# EAGLE design US_sous_marin (EAGLE 5.11)
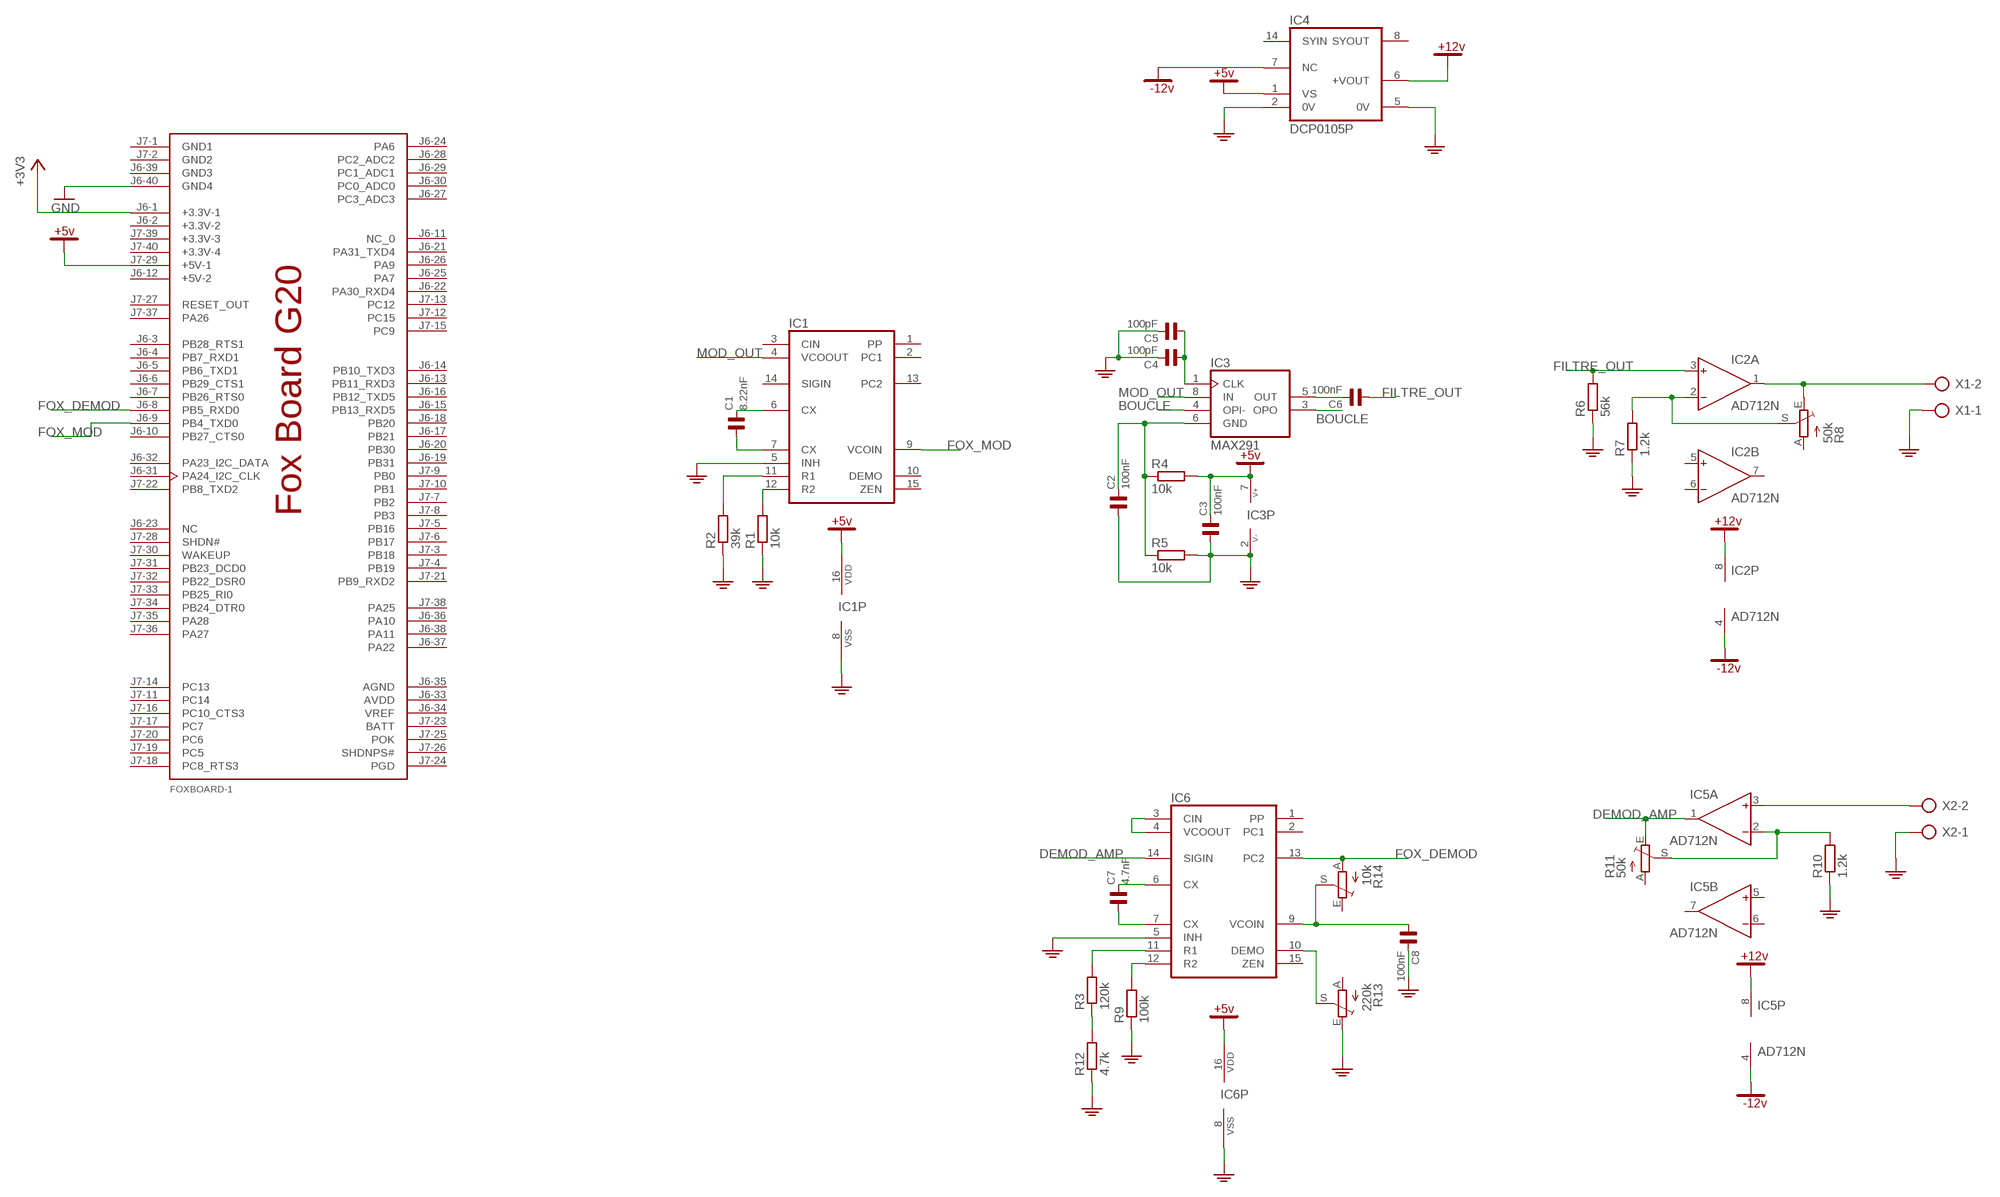
[diagram p0: schematic, sheet 1]

## Parts
C1  8.22nF  C5B2,5  [C5B2,5]
C2  100nF  C5B2,5E  [C5B2,5A]
C3  100nF  C5B2,5E  [C5B2,5A]
C4  100pF  C5B2,5  [C5B2,5]
C5  100pF  C5B2,5  [C5B2,5]
C6  100nF  C5B2,5E  [C5B2,5A]
C7  4.7nF  C5B2,5  [C5B2,5]
C8  100nF  C5B2,5E  [C5B2,5A]
FOXBOARD-1  FOX-BOARD  [FOX-BOARD]
IC1  4046  [DIL16]
IC2  AD712N  [DIL08]
IC3  MAX291  [DIL08]
IC4  DCP0105P  [DIL14/7]
IC5  AD712N  [DIL08]
IC6  4046  [DIL16]
R1  10k  R-EU_0309/12  [0309/12]
R2  39k  R-EU_0309/12  [0309/12]
R3  120k  R-EU_0309/12  [0309/12]
R4  10k  R-EU_0309/12  [0309/12]
R5  10k  R-EU_0309/12  [0309/12]
R6  56k  R-EU_0309/12  [0309/12]
R7  1.2k  R-EU_0309/12  [0309/12]
R8  50k  TRIM_EU-B90P  [SP19L]
R9  100k  R-EU_0309/12  [0309/12]
R10  1.2k  R-EU_0309/12  [0309/12]
R11  50k  TRIM_EU-B90P  [SP19L]
R12  4.7k  R-EU_0309/12  [0309/12]
R13  220k  TRIM_EU-B90P  [SP19L]
R14  10k  TRIM_EU-S63P  [S63P]
X1  AK300/2  [AK300/2]
X2  AK300/2  [AK300/2]

## Nets
+3V3: FOXBOARD-1.J6-1(+3.3V-1)
+5V: C3.2 FOXBOARD-1.J7-29(+5V-1) IC1.16(VDD) IC3.7(V+) IC4.1(VS) IC6.16(VDD) R4.2
+12V: IC2.8(P:V+) IC4.6(+VOUT) IC5.8(P:V+)
-12V: IC2.4(P:V-) IC4.7(NC) IC5.4(P:V-)
BOUCLE: IC3.3(OPO) IC3.4(OPI-)
DEMOD_AMP: IC5.1(A:OUT) IC6.14(SIGIN) R11.E
FILTRE_OUT: C6.1 IC2.3(A:IN+) R6.2
FOX_DEMOD: FOXBOARD-1.J6-8(PB5_RXD0) IC6.13(PC2) R14.A
FOX_MOD: FOXBOARD-1.J6-9(PB4_TXD0) IC1.9(VCOIN)
GND: C2.1 C3.1 C4.2 C5.2 C8.2 FOXBOARD-1.J6-40(GND4) IC1.5(INH) IC1.8(VSS) IC3.2(V-) IC4.2(0V) IC4.5(0V) IC6.5(INH) IC6.8(VSS) R1.1 R2.1 R5.2 R6.1 R7.1 R9.1 R10.1 R12.1 R13.E X1.1 X2.1
MOD_OUT: IC1.4(VCOOUT) IC3.8(IN)
N$1: C1.2 IC1.6(CX)
N$2: C1.1 IC1.7(CX)
N$3: IC1.12(R2) R1.2
N$4: IC1.11(R1) R2.2
N$5: IC6.12(R2) R9.2
N$6: C6.2 IC3.5(OUT)
N$7: C2.2 IC3.6(GND) R4.1 R5.1
N$9: C4.1 C5.1 IC3.1(CLK)
N$10: IC2.2(A:IN-) R7.2 R8.S
N$11: IC2.1(A:OUT) R8.E X1.2
N$12: IC5.3(A:IN+) X2.2
N$13: IC6.3(CIN) IC6.4(VCOOUT)
N$14: IC5.2(A:IN-) R10.2 R11.S
N$15: C7.2 IC6.6(CX)
N$16: C7.1 IC6.7(CX)
N$17: IC6.11(R1) R3.2
N$18: R3.1 R12.2
N$19: IC6.10(DEMO) R13.S
N$21: C8.1 IC6.9(VCOIN) R14.S
Unconnected: FOXBOARD-1.J6-3(PB28_RTS1) FOXBOARD-1.J6-4(PB7_RXD1) FOXBOARD-1.J6-5(PB6_TXD1) FOXBOARD-1.J6-6(PB29_CTS1) FOXBOARD-1.J6-7(PB26_RTS0) FOXBOARD-1.J6-10(PB27_CTS0) FOXBOARD-1.J6-11(NC_0) FOXBOARD-1.J6-13(PB11_RXD3) FOXBOARD-1.J6-14(PB10_TXD3) FOXBOARD-1.J6-15(PB13_RXD5) FOXBOARD-1.J6-16(PB12_TXD5) FOXBOARD-1.J6-17(PB21) FOXBOARD-1.J6-18(PB20) FOXBOARD-1.J6-19(PB31) FOXBOARD-1.J6-20(PB30) FOXBOARD-1.J6-21(PA31_TXD4) FOXBOARD-1.J6-22(PA30_RXD4) FOXBOARD-1.J6-23(NC) FOXBOARD-1.J6-24(PA6) FOXBOARD-1.J6-25(PA7) FOXBOARD-1.J6-26(PA9) FOXBOARD-1.J6-27(PC3_ADC3) FOXBOARD-1.J6-28(PC2_ADC2) FOXBOARD-1.J6-29(PC1_ADC1) FOXBOARD-1.J6-30(PC0_ADC0) FOXBOARD-1.J6-31(PA24_I2C_CLK) FOXBOARD-1.J6-32(PA23_I2C_DATA) FOXBOARD-1.J6-33(AVDD) FOXBOARD-1.J6-34(VREF) FOXBOARD-1.J6-35(AGND) FOXBOARD-1.J6-36(PA10) FOXBOARD-1.J6-37(PA22) FOXBOARD-1.J6-38(PA11) FOXBOARD-1.J7-3(PB18) FOXBOARD-1.J7-4(PB19) FOXBOARD-1.J7-5(PB16) FOXBOARD-1.J7-6(PB17) FOXBOARD-1.J7-7(PB2) FOXBOARD-1.J7-8(PB3) FOXBOARD-1.J7-9(PB0) FOXBOARD-1.J7-10(PB1) FOXBOARD-1.J7-11(PC14) FOXBOARD-1.J7-12(PC15) FOXBOARD-1.J7-13(PC12) FOXBOARD-1.J7-14(PC13) FOXBOARD-1.J7-15(PC9) FOXBOARD-1.J7-16(PC10_CTS3) FOXBOARD-1.J7-17(PC7) FOXBOARD-1.J7-18(PC8_RTS3) FOXBOARD-1.J7-19(PC5) FOXBOARD-1.J7-20(PC6) FOXBOARD-1.J7-21(PB9_RXD2) FOXBOARD-1.J7-22(PB8_TXD2) FOXBOARD-1.J7-23(BATT) FOXBOARD-1.J7-24(PGD) FOXBOARD-1.J7-25(POK) FOXBOARD-1.J7-26(SHDNPS#) FOXBOARD-1.J7-27(RESET_OUT) FOXBOARD-1.J7-28(SHDN#) FOXBOARD-1.J7-30(WAKEUP) FOXBOARD-1.J7-31(PB23_DCD0) FOXBOARD-1.J7-32(PB22_DSR0) FOXBOARD-1.J7-33(PB25_RI0) FOXBOARD-1.J7-34(PB24_DTR0) FOXBOARD-1.J7-35(PA28) FOXBOARD-1.J7-36(PA27) FOXBOARD-1.J7-37(PA26) FOXBOARD-1.J7-38(PA25) IC1.1(PP) IC1.2(PC1) IC1.3(CIN) IC1.10(DEMO) IC1.13(PC2) IC1.14(SIGIN) IC1.15(ZEN) IC2.5(B:IN+) IC2.6(B:IN-) IC2.7(B:OUT) IC4.8(SYOUT) IC4.14(SYIN) IC5.5(B:IN+) IC5.6(B:IN-) IC5.7(B:OUT) IC6.1(PP) IC6.2(PC1) IC6.15(ZEN) R8.A R11.A R13.A R14.E

## Power pins joined to a net without a drawn wire
+3.3V-2: FOXBOARD-1.J6-2(+3.3V-2)
+3.3V-3: FOXBOARD-1.J7-39(+3.3V-3)
+3.3V-4: FOXBOARD-1.J7-40(+3.3V-4)
+5V-2: FOXBOARD-1.J6-12(+5V-2)
GND1: FOXBOARD-1.J7-1(GND1)
GND2: FOXBOARD-1.J7-2(GND2)
GND3: FOXBOARD-1.J6-39(GND3)

## Library data of the parts
C1 C4 C5 C7 = CAP:C5B2,5
C2 C3 C6 C8 = CAP:C5B2,5E
FOXBOARD-1 = Julien:FOX-BOARD
IC1 IC6 = 40XX:4046
IC2 IC5 = analog-devices:AD712: Dual Precision, Low Cost, High Speed BiFET Op Amp Source: http://www.analog.com/static/imported-files/data_sheets/AD712.pdf; MF: ALTERA CORPORATION; MPN: AD712JNZ; OC_FARNELL: 9604898; OC_NEWARK: 59K4554
IC3 = maxim:MAX291: DIGITAL FILTER; MPN: MAX291CPA+; OC_FARNELL: unknown; OC_NEWARK: 67K4526
IC4 = burr-brown:DCP0105: DC/DC Converters Miniature 5V Input, 1W Isolated Unregulated; MPN: DCP010512BP-U; OC_FARNELL: 1461015; OC_NEWARK: 61M5777
R1-R7 R9 R10 R12 = rcl:R-EU_: RESISTOR, European symbol
R8 R11 R13 R14 = pot:TRIM_EU-: POTENTIOMETER
X1 X2 = con-ptr500:AK300/2: CONNECTOR; OC_FARNELL: unknown; OC_NEWARK: unknown

## Board
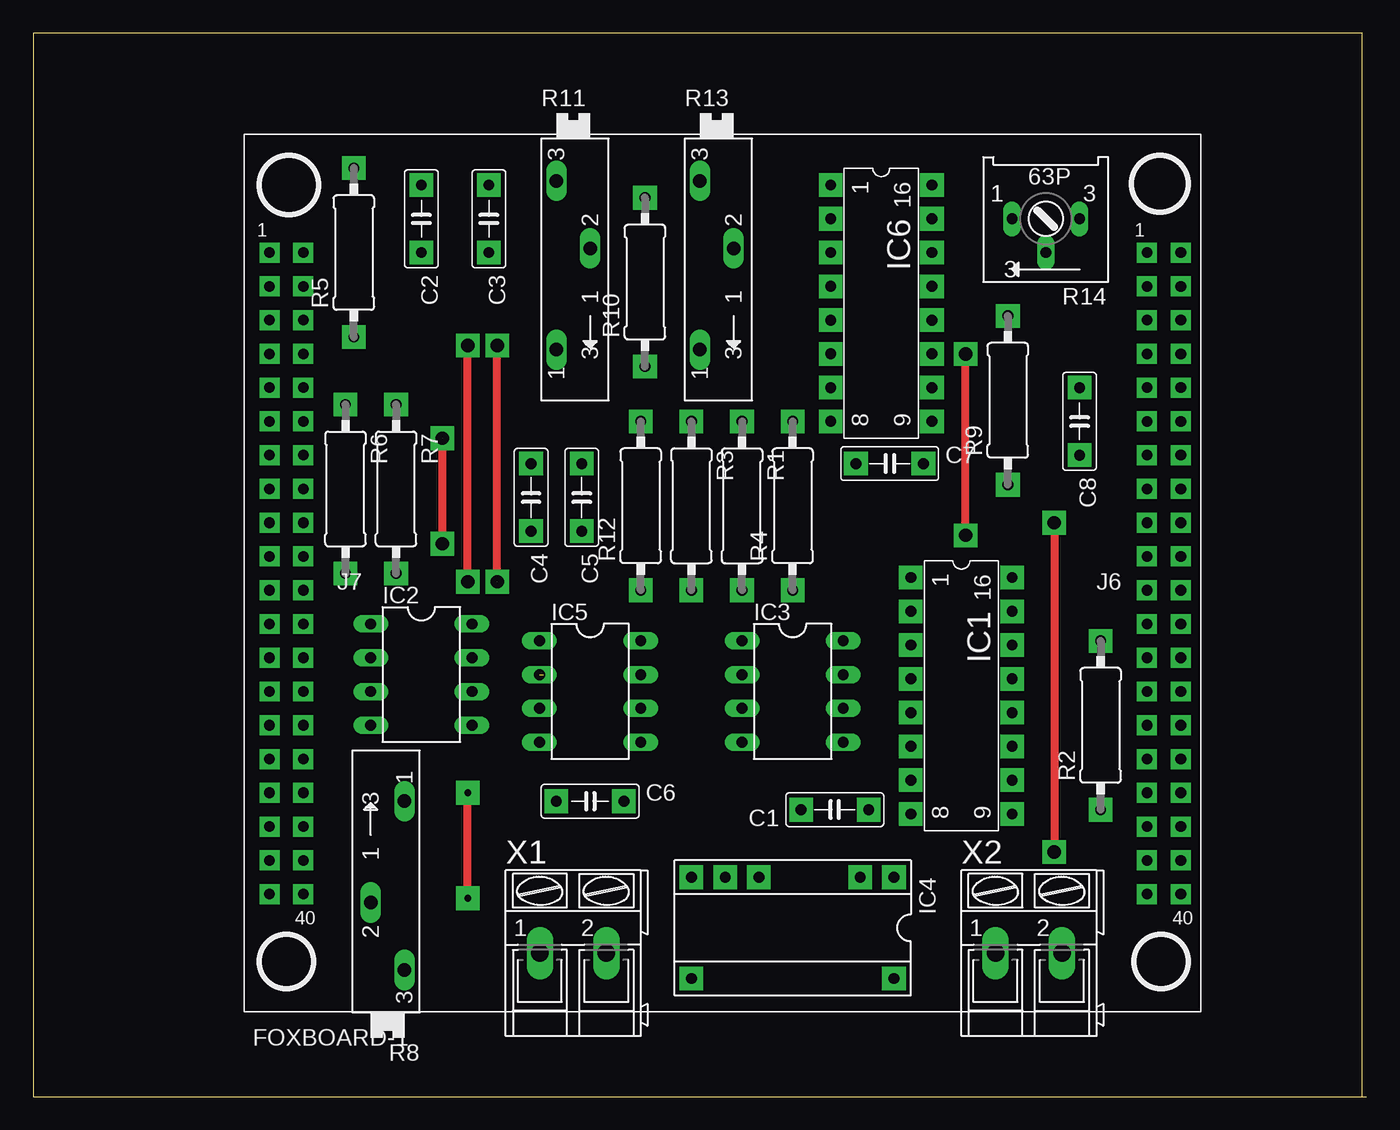
[diagram p1: board, top side]
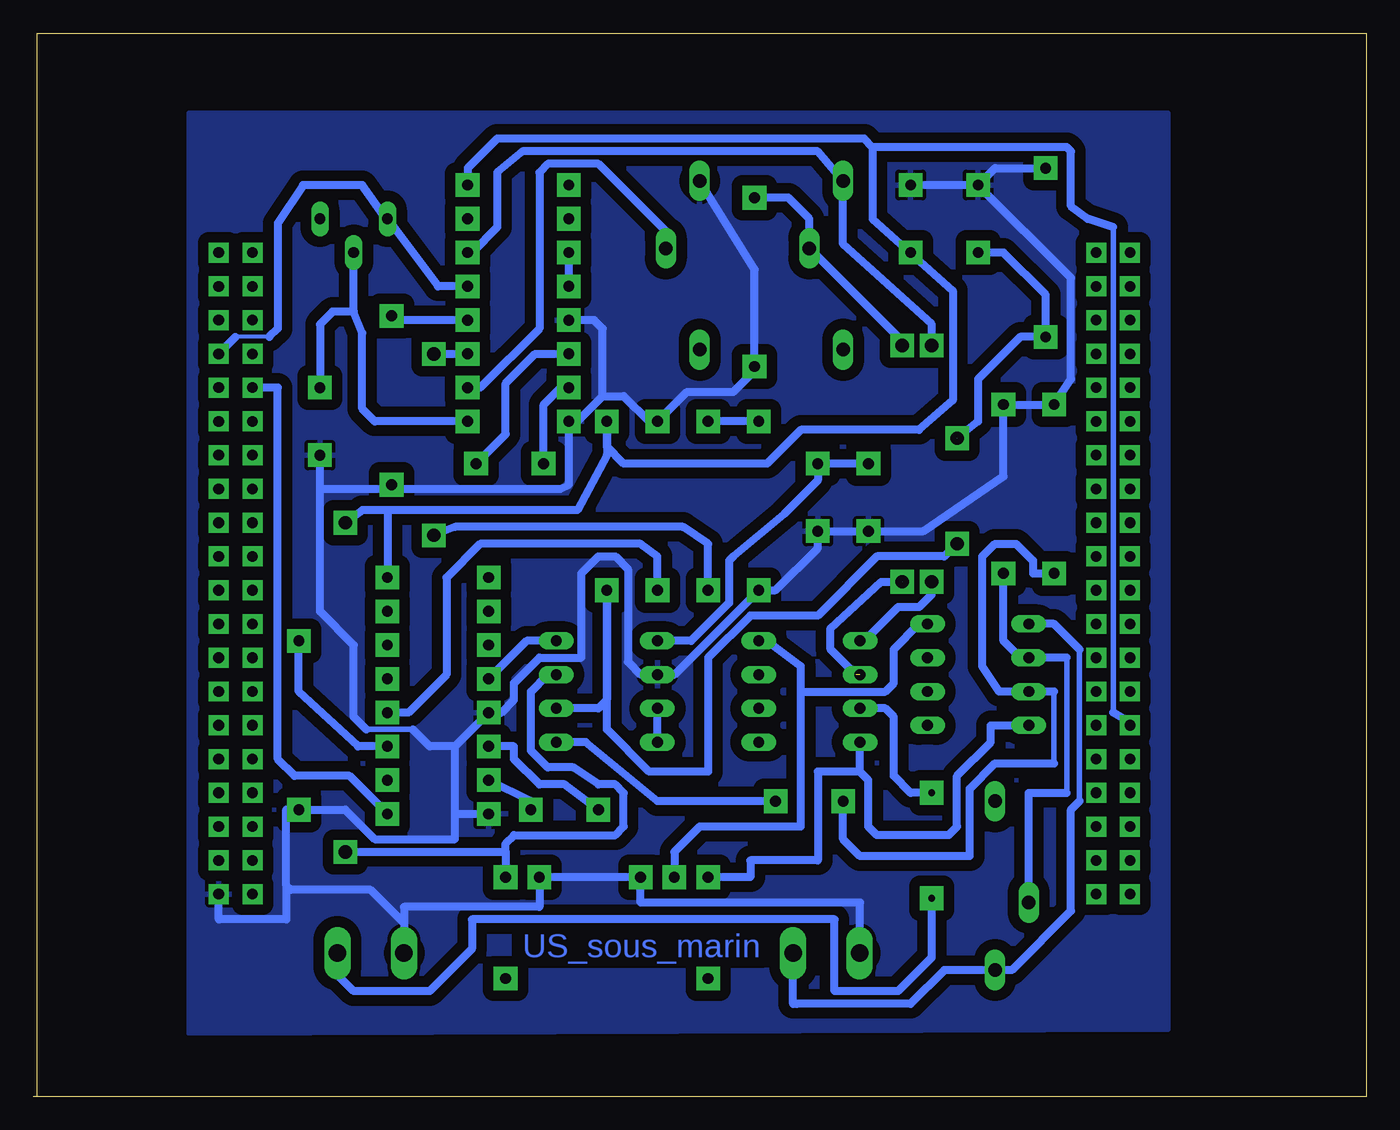
[diagram p2: board, bottom side, seen from below]

Size 100.32 x 80 mm. Coordinates in mm from the lower left corner, seen from the top.
Outline: 100,0 0,0 0,80 100,80 100,0
Outline: 100,0 100.32,0
Copper layers (1*16): Top 0.035mm / dielectric 1.5mm / Bottom 0.035mm
Design rules "default": minimum track width 10mil, minimum drill 24mil, track to track 8mil, track to pad 8mil, pad to pad 8mil, via to via 8mil, smd to smd 8mil, copper to edge 40mil, drill to drill 8mil, minimum pad ring 10mil, minimum via ring 8mil, stop-mask expansion 4mil, vias tented up to drill 0mil, thermal gap 10mil

### Footprints (pad centres in the part's own frame; a part is rotated, then mirrored left to right if it is on the bottom)
C5B2,5 = drill 0.813 pad 1.778 square: 1 -2.54,0; 2 2.54,0
C5B2,5A = drill 0.813 pad 1.778 square: 1 -2.54,0; 2 2.54,0
FOX-BOARD = drill 0.8 pad 1.5 square: J6-1 31.75,22.86; J6-2 34.29,22.86; J6-3 31.75,20.32; J6-4 34.29,20.32; J6-5 31.75,17.78; J6-6 34.29,17.78; J6-7 31.75,15.24; J6-8 34.29,15.24; J6-9 31.75,12.7; J6-10 34.29,12.7; J6-11 31.75,10.16; J6-12 34.29,10.16; J6-13 31.75,7.62; J6-14 34.29,7.62; J6-15 31.75,5.08; J6-16 34.29,5.08; J6-17 31.75,2.54; J6-18 34.29,2.54; J6-19 31.75,0; J6-20 34.29,0; J6-21 31.75,-2.54; J6-22 34.29,-2.54; J6-23 31.75,-5.08; J6-24 34.29,-5.08; J6-25 31.75,-7.62; J6-26 34.29,-7.62; J6-27 31.75,-10.16; J6-28 34.29,-10.16; J6-29 31.75,-12.7; J6-30 34.29,-12.7; J6-31 31.75,-15.24; J6-32 34.29,-15.24; J6-33 31.75,-17.78; J6-34 34.29,-17.78; J6-35 31.75,-20.32; J6-36 34.29,-20.32; J6-37 31.75,-22.86; J6-38 34.29,-22.86; J6-39 31.75,-25.4; J6-40 34.29,-25.4; J7-1 -34.29,22.86; J7-2 -31.75,22.86; J7-3 -34.29,20.32; J7-4 -31.75,20.32; J7-5 -34.29,17.78; J7-6 -31.75,17.78; J7-7 -34.29,15.24; J7-8 -31.75,15.24; J7-9 -34.29,12.7; J7-10 -31.75,12.7; J7-11 -34.29,10.16; J7-12 -31.75,10.16; J7-13 -34.29,7.62; J7-14 -31.75,7.62; J7-15 -34.29,5.08; J7-16 -31.75,5.08; J7-17 -34.29,2.54; J7-18 -31.75,2.54; J7-19 -34.29,0; J7-20 -31.75,0; J7-21 -34.29,-2.54; J7-22 -31.75,-2.54; J7-23 -34.29,-5.08; J7-24 -31.75,-5.08; J7-25 -34.29,-7.62; J7-26 -31.75,-7.62; J7-27 -34.29,-10.16; J7-28 -31.75,-10.16; J7-29 -34.29,-12.7; J7-30 -31.75,-12.7; J7-31 -34.29,-15.24; J7-32 -31.75,-15.24; J7-33 -34.29,-17.78; J7-34 -31.75,-17.78; J7-35 -34.29,-20.32; J7-36 -31.75,-20.32; J7-37 -34.29,-22.86; J7-38 -31.75,-22.86; J7-39 -34.29,-25.4; J7-40 -31.75,-25.4
DIL16 = drill 0.813 pad 1.778 square: 1 -8.89,-3.81; 2 -6.35,-3.81; 3 -3.81,-3.81; 4 -1.27,-3.81; 5 1.27,-3.81; 6 3.81,-3.81; 7 6.35,-3.81; 8 8.89,-3.81; 9 8.89,3.81; 10 6.35,3.81; 11 3.81,3.81; 12 1.27,3.81; 13 -1.27,3.81; 14 -3.81,3.81; 15 -6.35,3.81; 16 -8.89,3.81
DIL08 = drill 0.813 long: 1 -3.81,-3.81; 2 -1.27,-3.81; 3 1.27,-3.81; 4 3.81,-3.81; 5 3.81,3.81; 6 1.27,3.81; 7 -1.27,3.81; 8 -3.81,3.81
DIL14/7 = drill 0.813 pad 1.6 octagon: 1 -7.62,-3.81; 2 -5.08,-3.81; 5 2.54,-3.81; 6 5.08,-3.81; 7 7.62,-3.81; 8 7.62,3.81; 14 -7.62,3.81
0309/12 = drill 0.813 octagon: 1 -6.35,0; 2 6.35,0
SP19L = drill 1.016 long: A 5.715,-1.27; E -6.985,-1.27; S -1.905,1.27
S63P = drill 0.813 long: A 2.54,0; E -2.54,0; S 0,2.54
AK300/2 = drill 1.321 long: 1 -2.515,0; 2 2.489,0

### Placement (x,y rotation side)
C1  60.33,21.59 180 top
C2  29.21,66.04 270 top
C3  34.29,66.04 270 top
C4  37.47,45.09 270 top
C5  41.27,45.09 270 top
C6  41.91,22.23 0 top
C7  64.45,47.62 0 top
C8  78.74,50.8 270 top
FOXBOARD-1  52.07,40.64 0 top
IC1  69.85,30.16 270 top
IC2  29.21,31.75 270 top
IC3  57.15,30.48 270 top
IC4  57.15,12.7 180 top
IC5  41.91,30.48 270 top
IC6  63.82,59.69 270 top
R1  53.34,44.45 270 top
R2  80.33,27.94 90 top
R3  49.53,44.45 270 top
R4  57.15,44.45 90 top
R5  24.13,63.5 90 top
R6  23.5,45.72 270 top
R7  27.3,45.72 270 top
R8  26.67,16.51 90 top
R9  73.34,52.39 90 top
R10  46.04,61.28 90 top
R11  40.64,61.91 270 top
R12  45.72,44.45 90 top
R13  51.44,61.91 270 top
R14  76.2,66.04 180 top
X1  40.64,10.79 0 top
X2  74.93,10.79 0 top

### Tracks (layer width: path | path; a pad name or v marks a point on that pad's centre or on a via)
+5V  (via drill 1 pad 0.13)
  Top 0.61: v76.83,43.18 v76.83,18.41
  Bottom 0.406: 19.05,28.89 19.05,65.41
  Bottom 0.61: 64.77,18.41 64.77,19.05 64.14,19.68 56.52,19.68 55.88,20.32 55.88,22.86 56.52,23.5 57.78,23.5 59.69,24.77 61.59,24.77 62.87,26.04 62.87,30.48 61.59,31.75 IC3.7 | 64.77,18.41 IC4.1 | 73.66,44.13 IC1.16 | 73.66,44.13 59.37,44.13 57.15,48.26 R4.2 57.15,48.9 55.88,47.62 45.09,47.62 42.55,50.16 33.66,50.16 31.11,52.39 31.11,60.64 C3.2 37.15,66.04 37.15,71.44 | FOXBOARD-1.J7-29 17.46,27.94 19.05,28.89 | 19.05,65.41 20.95,66.04 22.23,66.99 22.23,71.12 22.54,71.44 37.15,71.44 | 73.66,44.13 75.56,44.13 v76.83,43.18 | v76.83,18.41 64.77,18.41 | IC6.16 67.63,69.85 65.41,72.07 37.78,72.07 37.15,71.44
+12V
  Bottom 0.61: IC5.8 45.09,34.29 42.55,32.38 42.55,30.48 | 42.55,30.48 42.55,20.32 50.16,20.32 52.07,18.41 IC4.6 | IC2.8 33.66,35.56 35.56,33.66 35.56,31.11 36.2,30.48 42.55,30.48
-12V
  Bottom 0.61: IC2.4 28.26,27.94 28.26,26.67 30.8,24.13 30.8,20.32 31.43,19.68 36.83,19.68 37.47,20.32 37.47,23.81 38.1,24.45 | 38.1,24.45 IC5.4 | IC4.7 46.35,16.51 46.35,17.78 41.27,17.78 41.27,24.45 38.1,24.45
BOUCLE
  Bottom 0.61: IC3.4 IC3.3
DEMOD_AMP  (via drill 1 pad 0.13)
  Top 0.61: v32.7,38.73 v32.7,56.52
  Bottom 0.61: IC6.14 67.31,63.5 65.41,65.41 65.41,69.53 63.5,71.12 41.27,71.12 R11.E 39.37,64.14 32.7,58.1 v32.7,56.52 | IC5.1 37.78,34.29 35.24,36.83 33.66,36.83 32.7,37.78 v32.7,38.73
FILTRE_OUT
  Bottom 0.406: 23.5,25.08 23.5,30.48
  Bottom 0.61: 23.5,25.08 27.94,25.08 29.84,23.18 29.84,18.1 38.1,18.1 39.37,19.37 C6.1 | 23.5,30.48 IC2.3 27.62,30.48 28.89,32.38 28.89,40.64 27.94,41.59 26.35,41.59 25.08,40.32 25.08,39.37 R6.2
FOX_DEMOD
  Bottom 0.305: 82.55,57.15 85.09,57.15
  Bottom 0.61: 82.55,57.15 81.92,57.78 81.92,65.72 80.01,68.58 75.56,68.58 73.98,66.36 R14.A 69.85,60.96 IC6.13 | 85.09,57.15 FOXBOARD-1.J6-8
FOX_MOD
  Bottom 0.61: FOXBOARD-1.J6-9 81.92,53.34 81.92,25.4 80.64,24.13 76.52,24.13 IC1.9
GND
  Bottom 0.406: 71.75,27.62 75.25,27.62
  Bottom 0.61: FOXBOARD-1.J6-40 86.36,13.34 81.28,13.34 81.28,15.88 | X1.1 38.1,11.11 38.1,14.61 54.61,14.61 IC4.5 IC4.2 62.23,14.29 72.42,14.29 72.42,13.04 | 81.28,15.88 81.28,21.59 R2.1 76.83,21.59 74.61,19.37 68.58,19.37 68.58,21.27 | 68.58,21.27 IC1.8 | C2.1 C3.1 | C2.1 22.23,61.59 22.23,53.98 R6.1 R7.1 27.3,46.67 33.34,42.55 C4.2 C5.2 41.27,41.27 44.45,38.1 R12.1 52.07,31.75 IC3.2 54.61,31.75 55.56,32.7 55.56,39.69 56.52,40.64 57.78,40.64 59.05,39.37 59.05,33.02 62.23,33.02 64.14,31.11 64.14,29.84 65.09,28.89 IC1.5 68.58,26.35 | 78.74,45.72 73.34,45.72 | 73.34,45.72 60.64,45.72 60.01,46.04 IC6.8 59.37,50.8 57.47,52.7 | 78.74,45.72 C8.2 | 73.34,45.72 R9.1 | R13.E 46.04,62.23 R10.1 46.04,54.61 47.62,53.02 51.12,53.02 R1.1 53.98,50.8 55.88,52.7 57.47,52.7 | R5.2 27.94,69.85 C2.1 | 57.47,52.7 57.47,57.78 58.1,58.42 IC6.5 | 68.58,21.27 68.58,26.35 | 68.58,26.35 70.48,26.35 71.75,27.62 | 75.25,27.62 76.2,28.57 76.2,33.97 78.74,36.51 78.74,45.72 | 72.42,13.04 X2.1 | 72.42,13.04 74.93,15.56 80.96,15.56 81.28,15.88
  pour Bottom (isolate 0.813): 14.92,73.98 88.58,73.98 88.58,4.76 14.92,5.08
MOD_OUT
  Bottom 0.61: IC3.8 63.18,34.29 IC1.4
N$1
  Bottom 0.61: IC1.6 64.14,26.35 64.14,25.4 62.23,23.5 60.33,23.5 C1.2
N$2
  Bottom 0.61: C1.1 62.87,22.23 IC1.7
N$3
  Bottom 0.61: R1.2 53.34,40.64 54.61,41.59 66.67,41.59 69.22,39.05 69.22,31.75 72.07,28.89 IC1.12
N$4
  Bottom 0.61: IC1.11 75.88,26.35 80.33,30.48 R2.2
N$5
  Bottom 0.61: IC6.12 73.03,58.42 R9.2
N$6
  Bottom 0.61: C6.2 53.34,22.23 58.74,26.67 IC3.5
N$7  (via drill 1 pad 0.13)  (1 unrouted)
  Top 0.61: v30.8,41.59 30.8,49.53
  Bottom 0.61: IC3.6 57.78,29.21 57.15,29.84 R4.1 57.15,27.62 53.98,24.45 49.53,24.45 49.53,33.02 46.35,36.2 41.27,36.2 36.83,40.64 31.75,40.64 v30.8,41.59 | C2.2 27.3,63.5 24.13,60.33 R5.1 26.04,57.15 29.21,53.98 29.21,50.8 30.8,49.53
N$9
  Bottom 0.61: C4.1 C5.1 41.27,46.35 43.81,43.81 47.62,40.64 47.94,40.32 47.94,37.15 50.8,34.29 IC3.1
N$10
  Bottom 0.406: 22.54,22.86 22.54,33.02
  Bottom 0.61: R8.S 25.4,22.86 22.54,22.86 | 22.54,33.02 IC2.2 26.04,33.02 27.3,34.29 R7.2
N$11
  Bottom 0.406: 21.59,22.23 21.59,33.66
  Bottom 0.61: X1.2 43.13,6.99 42.86,6.99 34.29,6.99 31.75,9.53 R8.E 26.67,9.53 22.23,13.97 22.23,21.59 21.59,22.23 | 21.59,33.66 23.5,35.56 IC2.1
N$12  (via drill 0.5 pad 1.78)
  Top 0.61: v32.7,14.92 v32.7,22.86
  Bottom 0.61: IC5.3 36.2,29.21 35.56,28.57 35.56,24.13 34.29,22.86 v32.7,22.86 | X2.2 77.47,10.74 77.47,9.21 76.2,7.94 70.48,7.94 67.31,11.11 67.31,13.34 40.01,13.34 40.01,7.94 35.24,7.94 32.7,10.48 v32.7,14.92
N$13
  Bottom 0.61: IC6.4 IC6.3
N$14  (via drill 1 pad 0.13)  (2 unrouted)
  Top 0.61: 34.92,38.73 v34.92,56.52
  Bottom 0.61: R10.2 43.5,67.63 41.91,66.04 R11.S | 35.24,56.83 v34.92,56.52 34.92,56.83 R11.S | R11.S 41.91,63.5 | 38.42,31.75 40.32,33.66 40.32,35.24 36.51,38.73 34.92,38.73
N$15
  Bottom 0.61: IC6.6 62.55,55.88 64.77,53.66 64.77,49.85 C7.2 67.31,47.31
N$16
  Bottom 0.61: IC6.7 60.64,53.34 61.91,52.07 C7.1
N$17  (via drill 1 pad 0.13)
  Top 0.61: v70.17,42.23 v70.17,55.88
  Bottom 0.61: R3.2 49.53,41.59 51.44,42.86 68.58,42.86 v70.17,42.23 | v70.17,55.88 IC6.11
N$18
  Bottom 0.61: R12.2 R3.1
N$19
  Bottom 0.61: IC6.10 66.67,53.34 62.23,57.78 62.23,69.53 61.59,70.17 57.78,70.17 52.7,65.09 R13.S
N$20  (via drill 0.5 pad 1.42)
  other vias: 43.18,10.79
N$21
  Bottom 0.61: IC6.9 74.61,50.8 75.56,51.75 75.56,57.47 76.2,59.05 | 76.2,59.05 R14.S | 76.2,59.05 77.79,59.05 78.74,58.1 C8.1
N$22  (via drill 1 pad 0.13)
  other vias: 76.83,43.18
N$23  (via drill 0.5 pad 1.42)
  other vias: 77.47,10.79
N$24  (via drill 1 pad 0.13)
  other vias: 30.8,49.53
N$25  (via drill 0.5 pad 1.42)
  other vias: 27.94,22.23
N$26  (via drill 1 pad 0.13)
  other vias: 34.92,38.73
N$27  (via drill 0.5 pad 1.42)
  other vias: 25.4,14.61
N$28  (via drill 0.5 pad 1.42)
  other vias: 27.94,9.53
N$29  (via drill 0.5 pad 1.42)
  other vias: 38.1,10.79
N$30  (via drill 0.5 pad 1.42)
  other vias: 52.7,63.82
N$31  (via drill 0.5 pad 1.42)
  other vias: 72.39,10.79
N$32  (via drill 1 pad 0.13)
  other vias: 76.83,18.41
N$33  (via drill 0.5 pad 1.42)
  other vias: 39.37,68.9
N$34  (via drill 0.5 pad 1.42)
  other vias: 41.91,63.82
N$35  (via drill 0.5 pad 1.42)
  other vias: 50.16,68.9
N$36  (via drill 0.5 pad 1.42)
  other vias: 50.16,56.2
N$37  (via drill 0.5 pad 1.42)
  other vias: 39.37,56.2
S$1  (via drill 1 pad 0.13)
  other vias: 70.17,42.23
S$2  (via drill 1 pad 0.13)
  other vias: 30.8,41.59
S$3  (via drill 0.5 pad 1.78)
  other vias: 80.33,21.59
S$5  (via drill 0.5 pad 1.78)
  other vias: 24.13,69.85
S$6  (via drill 0.5 pad 1.78)
  other vias: 57.15,38.1
S$7  (via drill 0.5 pad 1.78)
  other vias: 23.5,52.07
S$8  (via drill 0.5 pad 1.78)
  other vias: 27.3,52.07
S$9  (via drill 0.5 pad 1.78)
  other vias: 27.3,39.37
S$10  (via drill 0.5 pad 1.78)
  other vias: 23.5,39.37
S$11  (via drill 0.5 pad 1.78)
  other vias: 30.8,49.53
S$12  (via drill 0.5 pad 1.78)
  other vias: 30.8,41.59
S$13  (via drill 0.5 pad 1.78)
  other vias: 32.7,38.73
S$14  (via drill 0.5 pad 1.78)
  other vias: 34.92,38.73
S$15  (via drill 0.5 pad 1.78)
  other vias: 45.72,38.1
S$16  (via drill 0.5 pad 1.78)
  other vias: 49.53,38.1
S$17  (via drill 0.5 pad 1.78)
  other vias: 53.34,38.1
S$18  (via drill 0.5 pad 1.78)
  other vias: 32.7,56.52
S$19  (via drill 0.5 pad 1.78)
  other vias: 34.92,56.52
S$20  (via drill 0.5 pad 1.78)
  other vias: 46.04,67.63
S$21  (via drill 0.5 pad 1.78)
  other vias: 49.53,50.8
S$22  (via drill 0.5 pad 1.78)
  other vias: 45.72,50.8
S$23  (via drill 0.5 pad 1.78)
  other vias: 53.34,50.8
S$24  (via drill 0.5 pad 1.78)
  other vias: 57.15,50.8
S$25  (via drill 0.5 pad 1.78)
  other vias: 46.04,54.93
S$26  (via drill 0.5 pad 1.78)
  other vias: 73.34,58.74
S$27  (via drill 0.5 pad 1.78)
  other vias: 70.17,55.88
S$28  (via drill 0.5 pad 1.78)
  other vias: 73.34,46.04
S$29  (via drill 0.5 pad 1.78)
  other vias: 70.17,42.23
S$30  (via drill 0.5 pad 1.78)
  other vias: 76.83,43.18
S$31  (via drill 0.5 pad 1.78)
  other vias: 80.33,34.29
S$32  (via drill 0.5 pad 1.78)
  other vias: 76.83,18.41
S$33  (via drill 0.5 pad 1.78)
  other vias: 24.13,57.15
S$34  (via drill 0.5 pad 1.78)
  other vias: 62.23,16.51
S$35  (via drill 0.5 pad 1.78)
  other vias: 49.53,8.89
S$36  (via drill 0.5 pad 1.78)
  other vias: 32.7,22.86
S$37  (via drill 0.5 pad 1.78)
  other vias: 32.7,14.92
S$39  (via drill 0.5 pad 1.78)
  other vias: 64.77,8.89
S$40  (via drill 0.5 pad 1.78)
  other vias: 64.77,16.51
S$41  (via drill 0.5 pad 1.78)
  other vias: 52.07,16.51
S$42  (via drill 0.5 pad 1.78)
  other vias: 49.53,16.51
S$43  (via drill 0.5 pad 1.78)
  other vias: 54.61,16.51

### Text on the board
Bottom: US_sous_marin